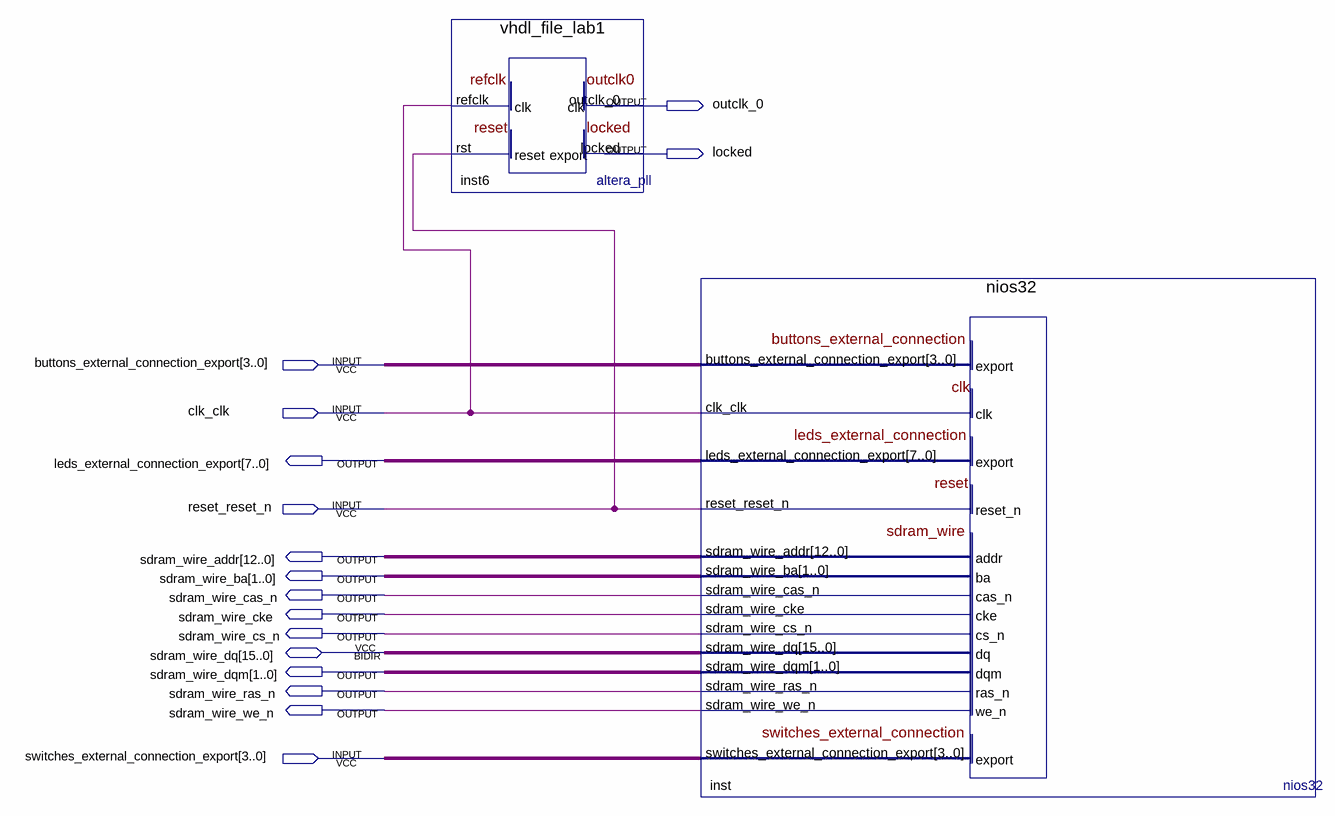
[diagram p0: schematic sheet]
// Quartus schematic rpds17.bdf as structural Verilog: 2 symbols, 16 pins
module rpds17 (
  input  [3:0] buttons_external_connection_export,
  input  clk_clk,
  input  reset_reset_n,
  input  [3:0] switches_external_connection_export,
  inout  [15:0] sdram_wire_dq,
  output outclk_0,
  output locked,
  output [7:0] leds_external_connection_export,
  output [12:0] sdram_wire_addr,
  output [1:0] sdram_wire_ba,
  output sdram_wire_cas_n,
  output sdram_wire_cke,
  output sdram_wire_cs_n,
  output [1:0] sdram_wire_dqm,
  output sdram_wire_ras_n,
  output sdram_wire_we_n
);

  vhdl_file_lab1 inst6 (.refclk(clk_clk), .rst(reset_reset_n), .outclk_0(outclk_0), .locked(locked));
  nios32 inst (
    .buttons_external_connection_export(buttons_external_connection_export), .clk_clk(clk_clk),
    .reset_reset_n(reset_reset_n), .switches_external_connection_export(switches_external_connection_export),
    .leds_external_connection_export(leds_external_connection_export), .sdram_wire_addr(sdram_wire_addr),
    .sdram_wire_ba(sdram_wire_ba), .sdram_wire_cas_n(sdram_wire_cas_n), .sdram_wire_cke(sdram_wire_cke),
    .sdram_wire_cs_n(sdram_wire_cs_n), .sdram_wire_dqm(sdram_wire_dqm), .sdram_wire_ras_n(sdram_wire_ras_n),
    .sdram_wire_we_n(sdram_wire_we_n), .sdram_wire_dq(sdram_wire_dq));
endmodule
